# EAGLE schematic komagoma-2 (EAGLE 9.6.2)
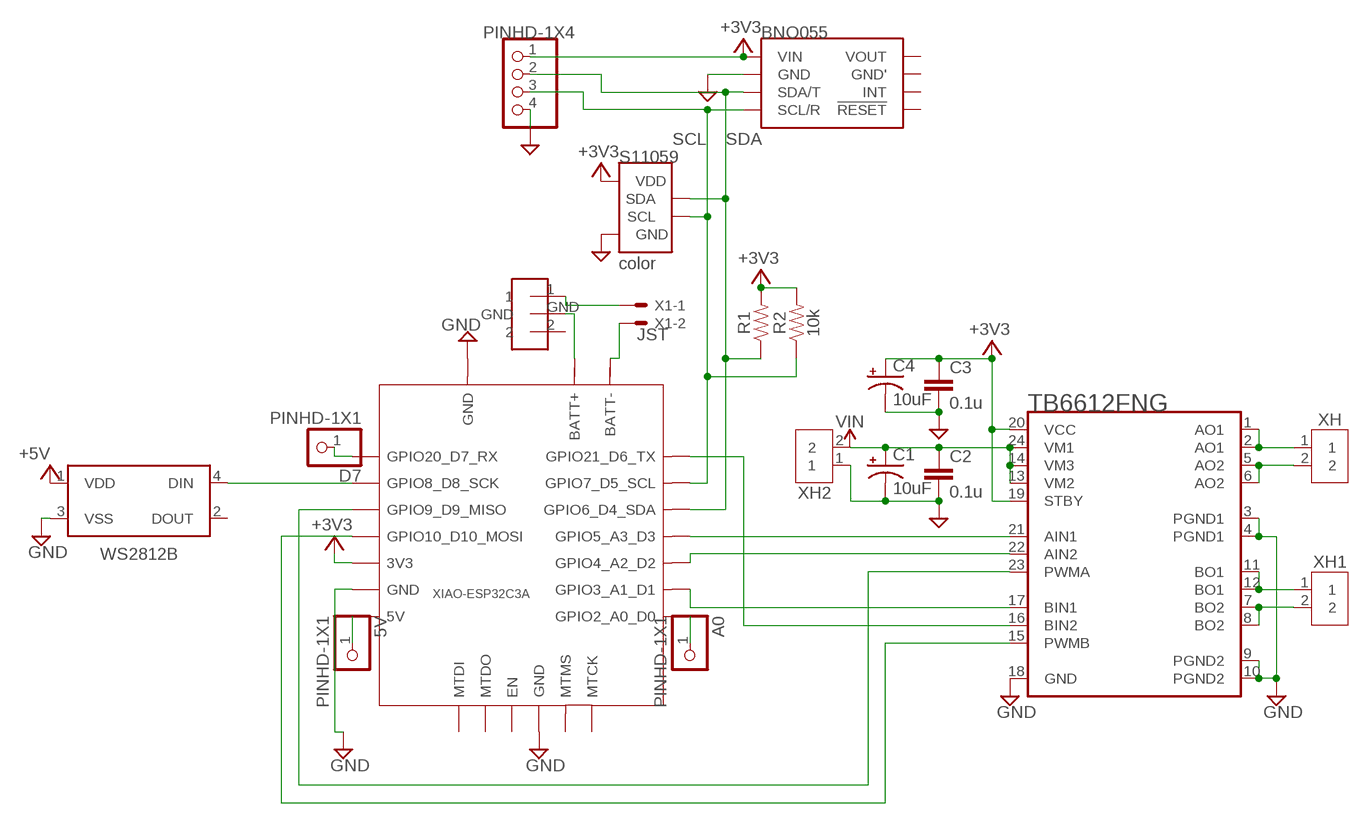
[diagram p0: schematic, sheet 1]

## Parts
5V  PINHD-1X1  [1X01]
A0  PINHD-1X1  [1X01]
C1  10uF  10UF-POLAR-RADIAL-2.5MM-KIT-25V-20%  [CPOL-RADIAL-2.5MM-5MM-KIT]
C2  0.1u  C-EUC1608  [C1608]
C3  0.1u  C-EUC1608  [C1608]
C4  10uF  10UF-POLAR-RADIAL-2.5MM-KIT-25V-20%  [CPOL-RADIAL-2.5MM-5MM-KIT]
CONNECTOR1  AKIZUKI_SWITCH_SOCKETAKIZUKI_SWITCH_SOCKET  [AKIZUKI_SWITCH]
D1  WS2812B  [WS2812B]
D7  PINHD-1X1  [1X01]
IC1  TB6612FNGSSOP24  [SOP65P760X160-24N]
JP1  PINHD-1X4  [1X04]
R1  10k  10KOHM-0603-1/10W-1%  [0603]
R2  10k  10KOHM-0603-1/10W-1%  [0603]
U1  XIAO-ESP32C3A  [XIAO-ESP32C3-THRUHOLE]
U$1  BNO055  [BNO055]
U$2  S11059  [S11059]
X1  JST-XH-02-PIN-LONG-PAD  [JST-XH-02-PACKAGE-LONG-PAD]
XH  3A/250V  B2B-XH-A  [B2B-XH-A]
XH1  3A/250V  B2B-XH-A  [B2B-XH-A]
XH2  3A/250V  B2B-XH-A  [B2B-XH-A]

## Nets
5V: 5V.1 U1.P$14(5V)
+3V3 [battery]: C3.1 C4.1(+) IC1.19(STBY) IC1.20(VCC) JP1.1 R1.2 R2.2 U1.P$12(3V3) U$1.P$1(VIN) U$2.P$4(VDD)
+5V [battery]: D1.1(VDD)
A0: A0.1 U1.P$1(GPIO2_A0_D0)
AO1 [VM]: IC1.1(AO1) IC1.2(AO1) XH.1
AO2 [VM]: IC1.5(AO2) IC1.6(AO2) XH.2
BAT+ [battery]: CONNECTOR1.GND U1.22(BATT+)
BAT- [battery]: U1.21(BATT-) X1.2
BATT [battery]: CONNECTOR1.1 X1.1
BO1 [VM]: IC1.11(BO1) IC1.12(BO1) XH1.1
BO2 [VM]: IC1.7(BO2) IC1.8(BO2) XH1.2
D7: D7.1 U1.P$8(GPIO20_D7_RX)
GND: C1.2(-) C2.2 C3.2 C4.2(-) D1.3(VSS) IC1.3(PGND1) IC1.4(PGND1) IC1.9(PGND2) IC1.10(PGND2) IC1.18(GND) JP1.4 U1.18(GND) U1.23(GND) U1.P$13(GND) U$1.P$2(GND) U$2.P$1(GND) XH2.1
N$3: IC1.21(AIN1) U1.P$4(GPIO5_A3_D3)
N$6: IC1.22(AIN2) U1.P$3(GPIO4_A2_D2)
N$8: IC1.17(BIN1) U1.P$2(GPIO3_A1_D1)
N$9: IC1.16(BIN2) U1.P$7(GPIO21_D6_TX)
N$10: IC1.15(PWMB) U1.P$11(GPIO10_D10_MOSI)
N$11: IC1.23(PWMA) U1.P$10(GPIO9_D9_MISO)
N$12: D1.4(DIN) U1.P$9(GPIO8_D8_SCK)
SCL: JP1.3 R2.1 U1.P$6(GPIO7_D5_SCL) U$1.P$4(SCL/R) U$2.P$2(SCL)
SDA: JP1.2 R1.1 U1.P$5(GPIO6_D4_SDA) U$1.P$3(SDA/T) U$2.P$3(SDA)
VM [VM]: C1.1(+) C2.1 IC1.13(VM2) IC1.14(VM3) IC1.24(VM1) XH2.2
Unconnected: CONNECTOR1.2 D1.2(DOUT) U1.15(MTDI) U1.16(MTDO) U1.17(EN) U1.19(MTMS) U1.20(MTCK) U$1.P$5(!RESET) U$1.P$6(INT) U$1.P$7(GND') U$1.P$8(VOUT)

## Notes on the sheet
- JST
- TB6612FNG

## Library data of the parts
5V A0 D7 = Connector:PINHD-1X1: PIN HEADER; CATEGORY: CONNECTOR; SUB-CATEGORY: PIN-HEADER
C1 C4 = SparkFun-Capacitors:10UF-POLAR: 10.0µF polarized capacitors A capacitor is a passive two-terminal electrical component used to store electrical energy temporarily in an electric field.; PROD_ID: CAP-08440
C2 C3 = resistor:C-EU: CAPACITOR, European symbol
CONNECTOR1 = Akizuki_Switch:AKIZUKI_SWITCH_SOCKET: Akizuki Switch
D1 = LED:WS2812B: Intelligent control LED integrated light source Datasheet <http://cdn.sparkfun.com/datasheets/BreakoutBoards/WS2812B.pdf>; CATEGORY: LED; COLOR: RGB; DESCRIPTION: LED integrated light source; MANUFACTURER: Worldsemi; MPN: WS2812B; OPERATING_TEMP: -25 ℃ to +80℃(TJ); PART_STATUS: Active; SUB_CATEGORY: RGB
IC1 = IC_Power-Management:TB6612FNG: Driver IC for Dual DC motor Datasheet <https://toshiba.semicon-storage.com/info/docget.jsp?did=10660&prodName=TB6612FNG>; CATEGORY: IC_Power-Management; MANUFACTURER: Toshiba; MPN: TB6612FNG,C,8,EL; OPERATING_TEMP: -20 to +85 °C; PART_STATUS: Active; ROHS_COMPLIANT: Compliant; SUB-CATEGORY: Motor Driver; THERMALLOSS: 0.78W
JP1 = Connector:PINHD-1X4: PIN HEADER; CATEGORY: CONNECTOR; SUB-CATEGORY: PIN-HEADER
R1 R2 = SparkFun-Resistors:10KOHM: 10kΩ resistor A resistor is a passive two-terminal electrical component that implements electrical resistance as a circuit element. Resistors act to reduce current flow, and, at the same time, act to lower voltage levels within circuits. - Wikipedia; PROD_ID: RES-00824
U1 = Seeed Studio XIAO Series:XIAO-ESP32C3: Seeed Studio XIAO ESP32C3 - Espressif ESP32-C3 WiFi BLE Microcontroller - 32-bit 160MHz RISC-V processor Seeed SKU: 113991054 Seeed Studio XIAO ESP32C3 featuring ESP32C3 carries a complete Wi-Fi system along with Bluetooth Low Energy function. With its exquisite design, WiFi+BT ability, it's perfect for various IoT controlling scenarios and complex carriable applications. Buy now <https://www.seeedstudio.com/Seeed-XIAO-ESP32C3-p-5431.html> Wiki <https://wiki.seeedstudio.com/XIAO_ESP32C3_Getting_Started/>
U$1 = UTlibraries:BNO055
U$2 = UTlibraries:S11059
X1 = Rembrandt Electronics - JST XH Connectors v1-0:JST-XH-02-PIN: JST XH Connector 2 Pin Wire to board connector. Pitch: 2,54 mm, (0.100") Number of pins: 2 Created by Rembrandt Electronics www.rembrandtelectronics.com
XH XH1 XH2 = Connector:B2B-XH-A: XH Connector Top Entry - 2POS Details see: Datasheet <http://www.jst-mfg.com/product/pdf/eng/eXH.pdf>; CATEGORY: CONNECTOR; DESCRIPTION: 2.5mm pitch/disconnectable crimp style connector; MANUFACTURER: JST (XH CONNECTOR); MPN: B2B-XH-A; OPERATING_TEMPERATURE: -25°C ~ 85°C; PART_STATUS: ACTIVE; ROHS_COMPLIANT: COMPLIANT; SERIES: B_B-XH-A; SUB_CATEGORY: Through hole connector; TYPE: top entry

## Net classes
0 default: width 0.15 mm
2 battery: width 0.5 mm
3 VM: width 0.4 mm